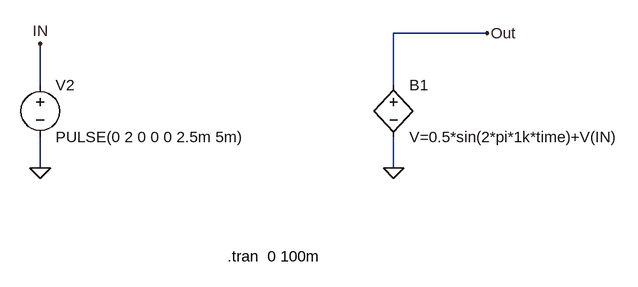
[diagram p0: schematic Draft2.asc]
Draft2.asc, the LTspice schematic file:
Version 4.1
SHEET 1 880 680
WIRE 320 32 176 32
WIRE -368 112 -368 48
WIRE 176 112 176 32
WIRE -368 240 -368 192
WIRE 176 240 176 192
FLAG -368 240 0
FLAG 176 240 0
FLAG -368 48 IN
FLAG 320 32 Out
SYMBOL bv 176 96 R0
SYMATTR InstName B1
SYMATTR Value V=0.5*sin(2*pi*1k*time)+V(IN)
SYMBOL voltage -368 96 R0
WINDOW 123 0 0 Left 0
WINDOW 39 0 0 Left 0
SYMATTR InstName V2
SYMATTR Value PULSE(0 2 0 0 0 2.5m 5m)
TEXT -80 376 Left 2 !.tran  0 100m

The netlist it stands for:
* Draft2.asc
B1 Out 0 V=0.5*sin(2*pi*1k*time)+V(IN)
V2 IN 0 PULSE(0 2 0 0 0 2.5m 5m)
.tran  0 100m
.backanno
.end